# EAGLE schematic n64adv2 (EAGLE 9.6.2)

## Sheet 1 of 3
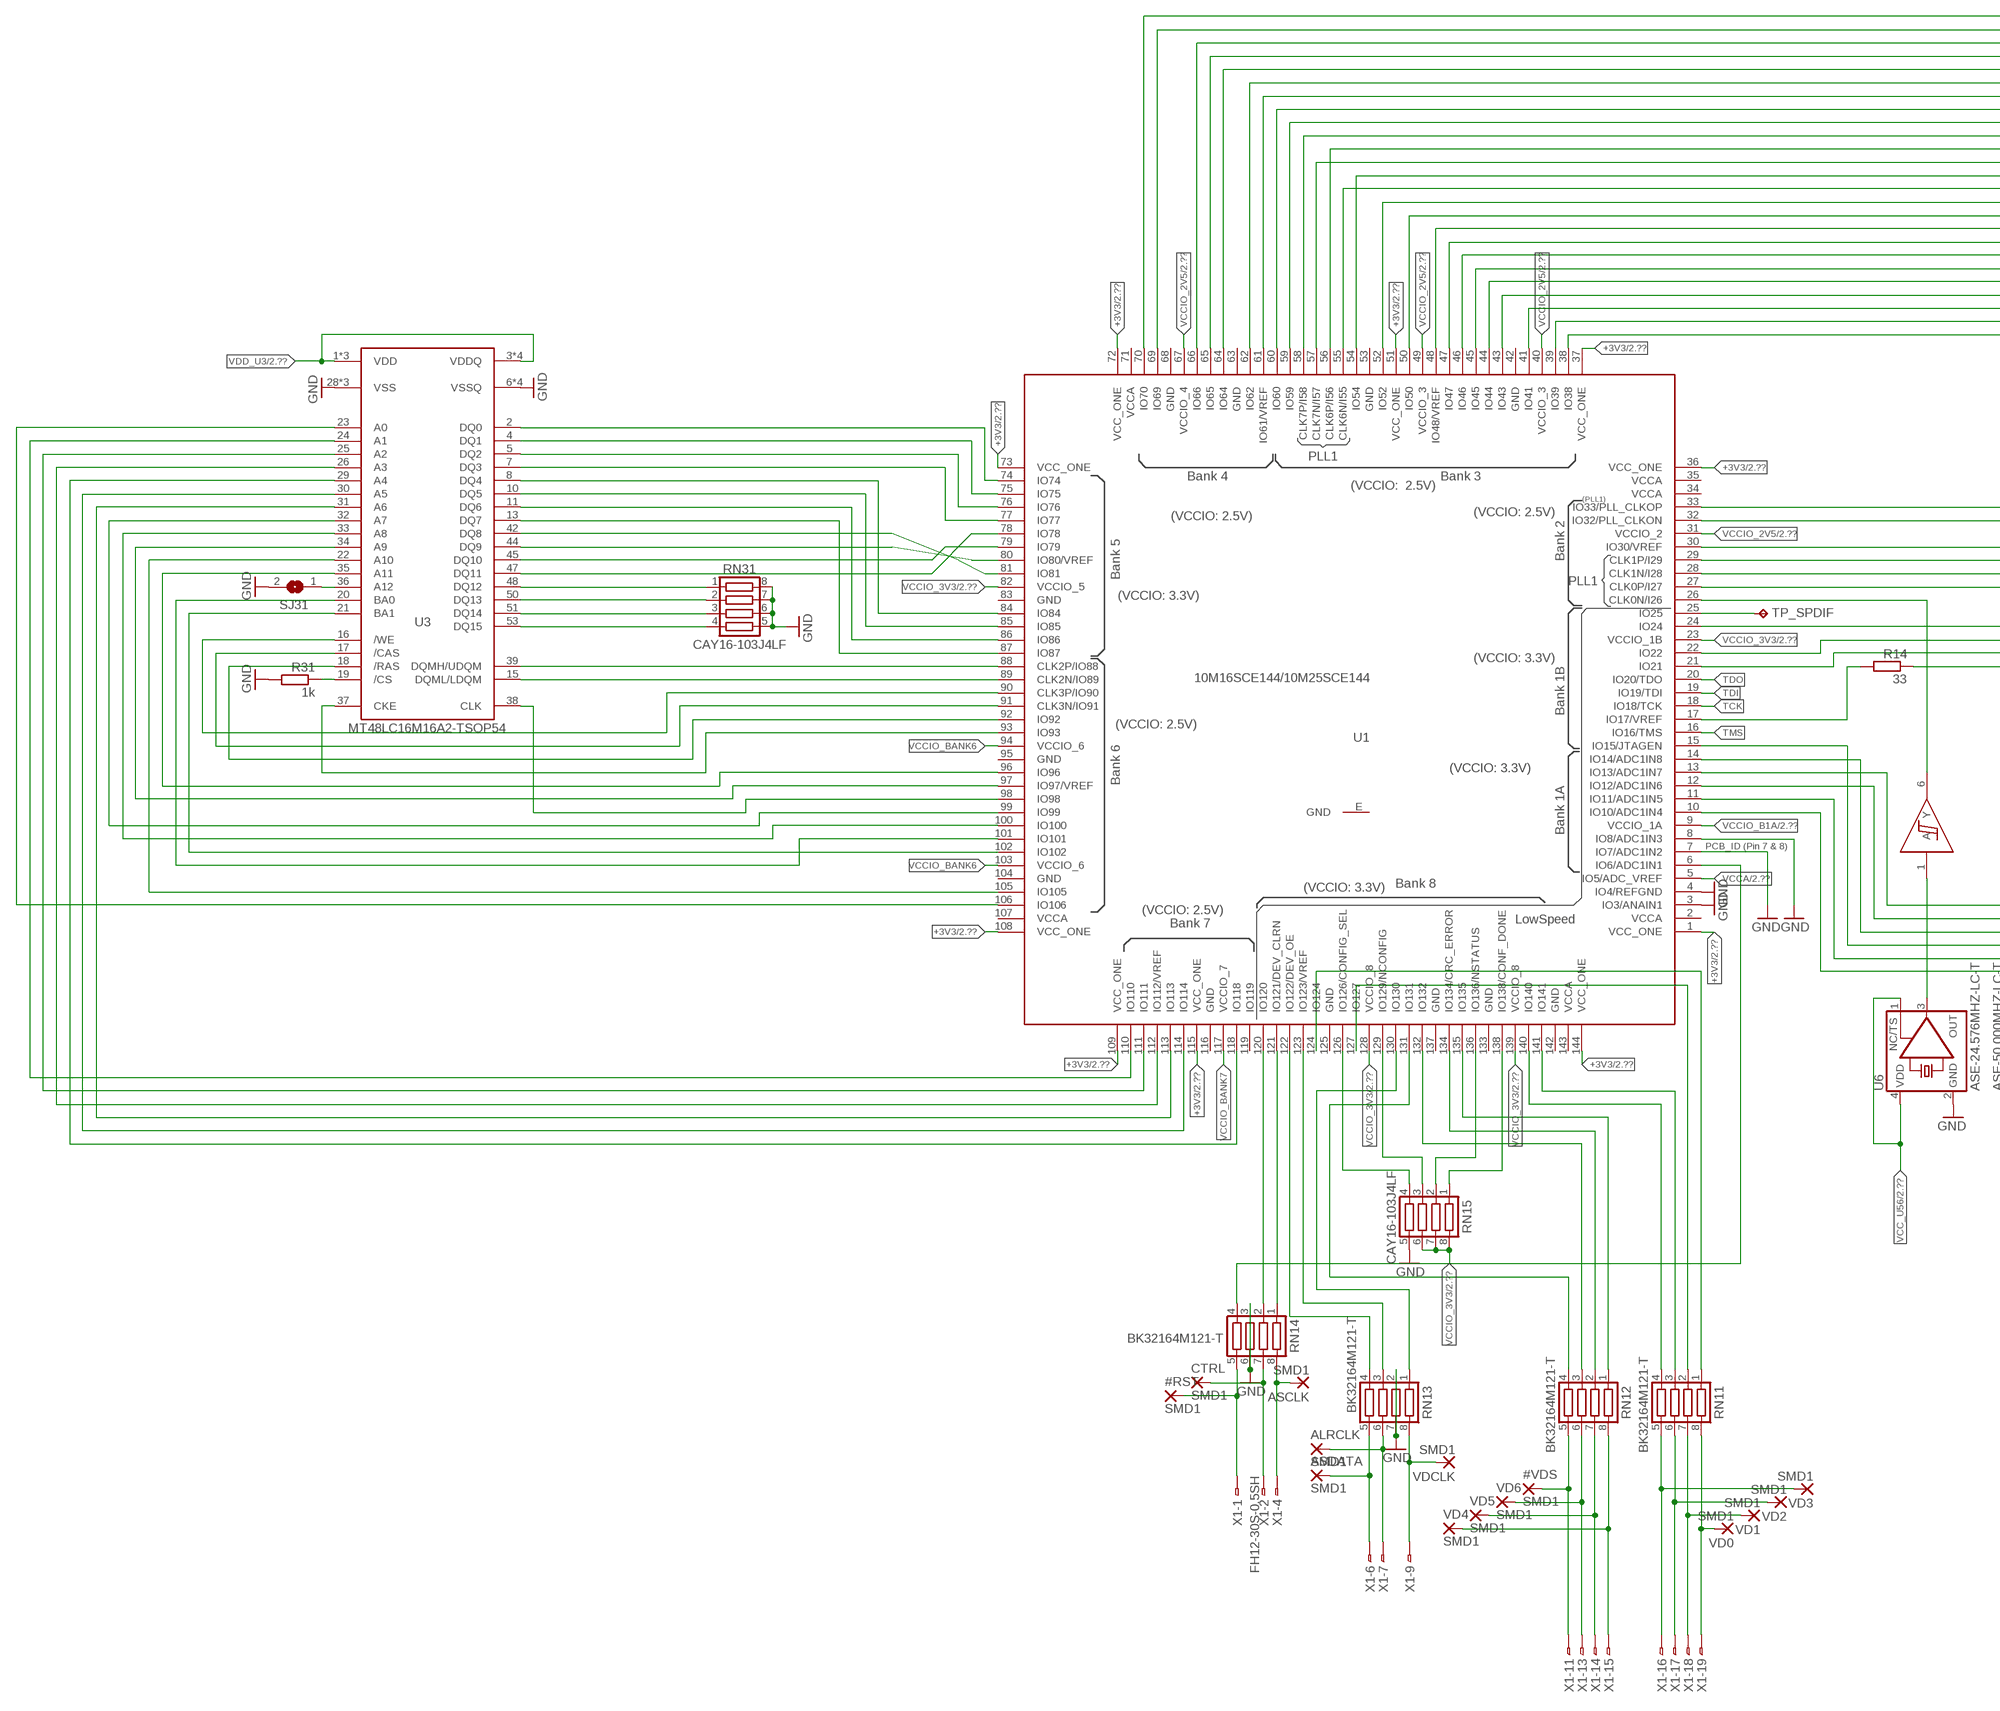
[diagram p0: schematic, sheet 1, part 1 of 2]
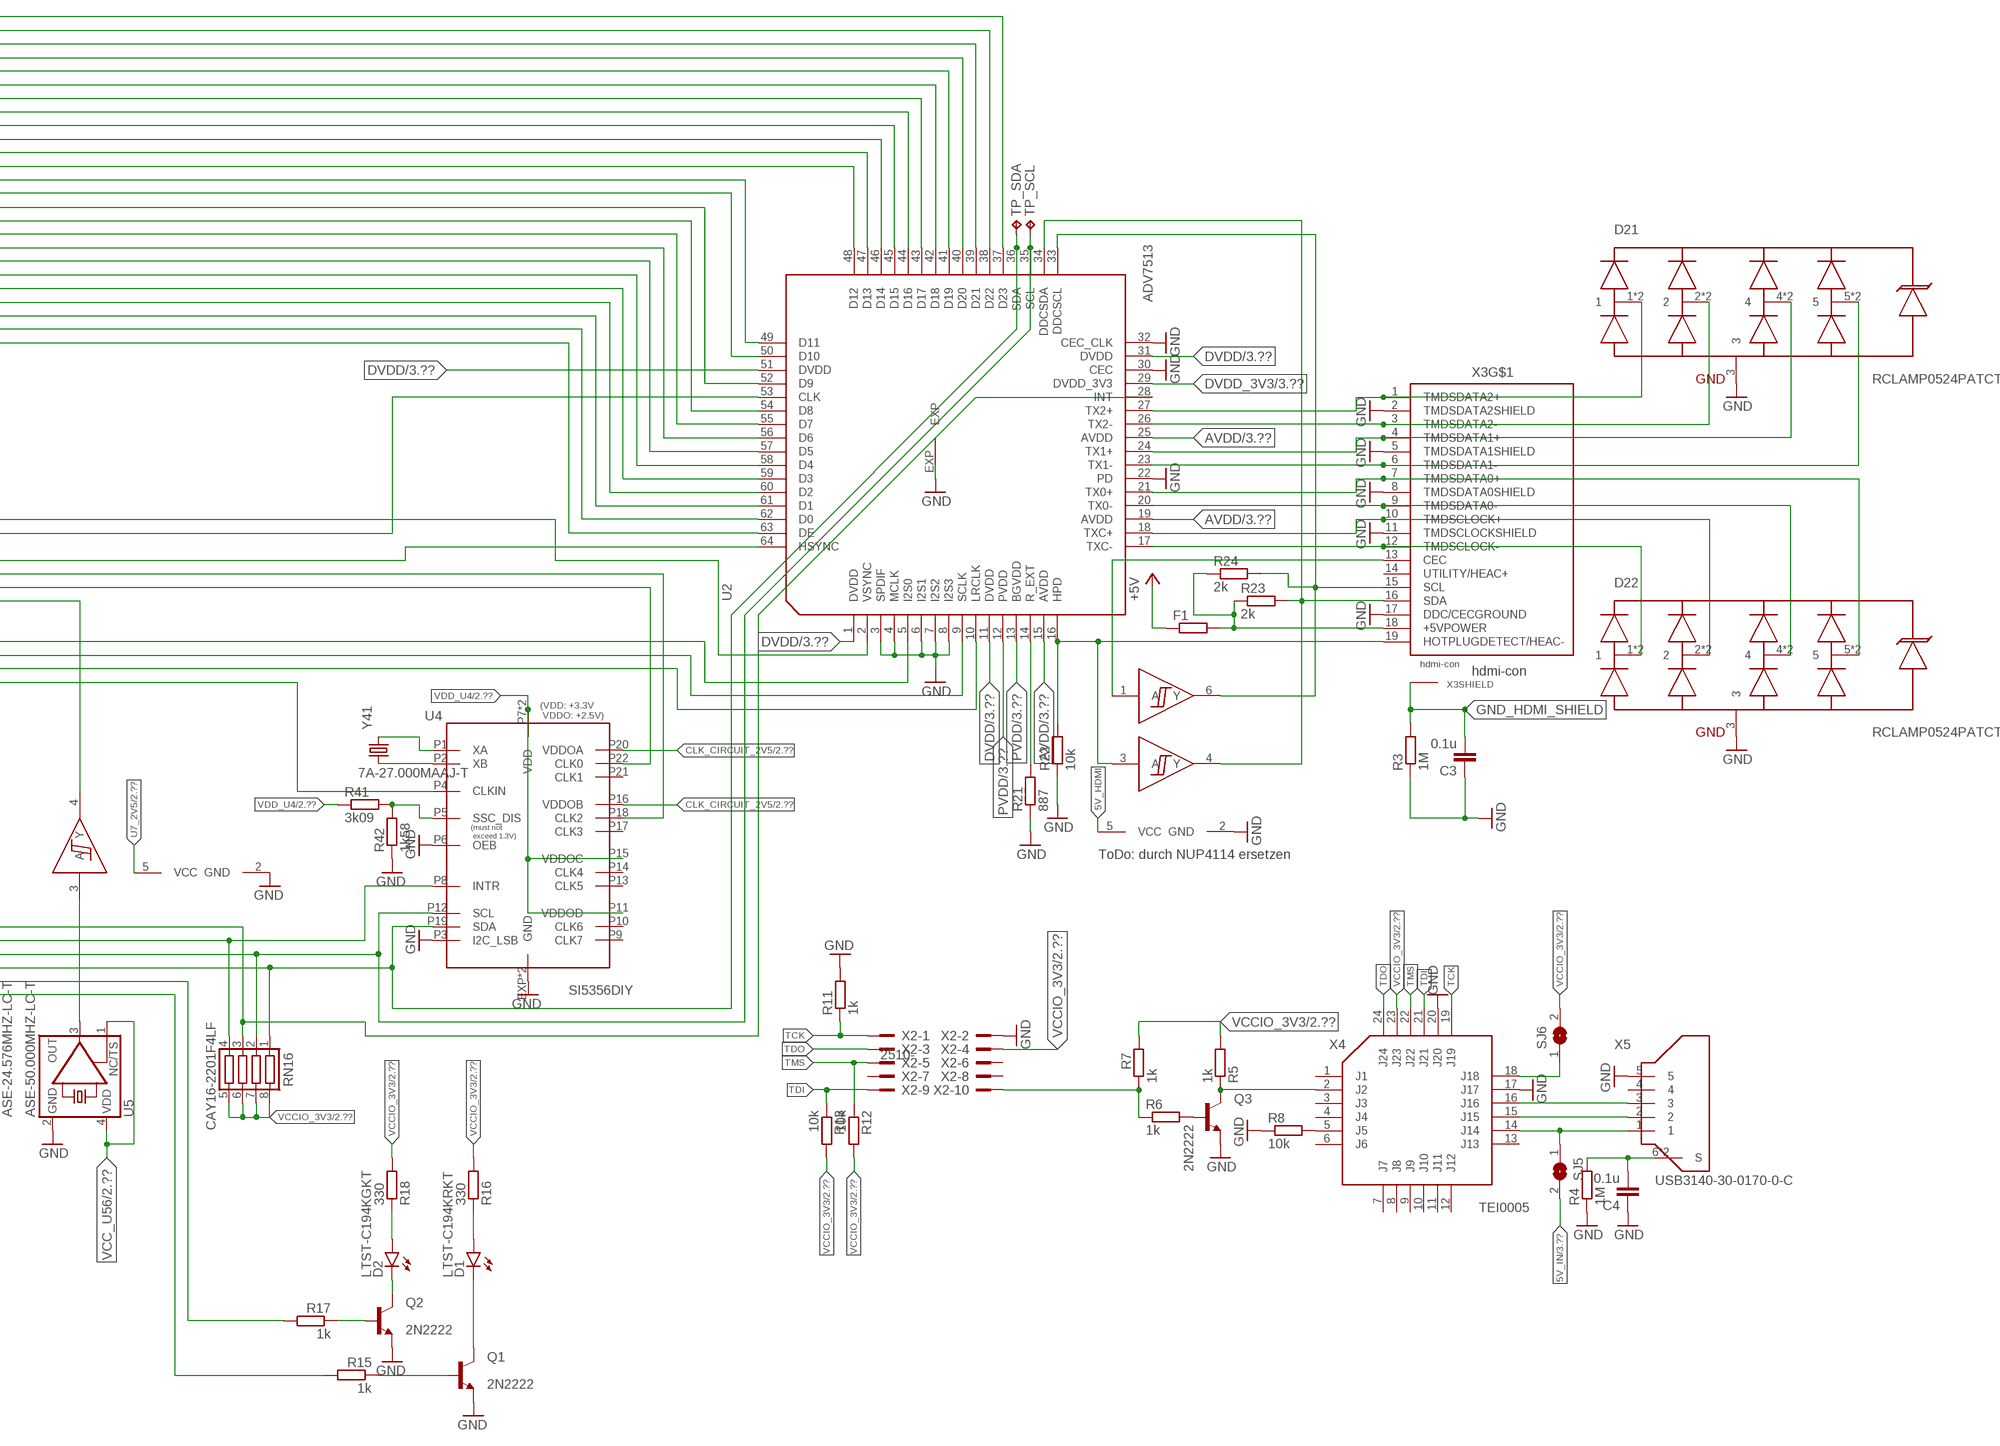
[diagram p1: schematic, sheet 1, part 2 of 2]

### Parts
#RST  SMD1  [SMD0,8-1,6]
#VDS  SMD1  [SMD0,8-1,6]
ALRCLK  SMD1  [SMD0,8-1,6]
ASCLK  SMD1  [SMD0,8-1,6]
ASDATA  SMD1  [SMD0,8-1,6]
C3  0.1u  C-EUC0603  [C0603]
C4  0.1u  C-EUC0603  [C0603]
CTRL  SMD1  [SMD0,8-1,6]
D1  LTST-C194KRKT  LEDCHIPLED_0805  [CHIPLED_0805]
D2  LTST-C194KGKT  LEDCHIPLED_0805  [CHIPLED_0805]
D21  RCLAMP0524PATCT  HDMI_RCLAMP  [HDMI_RCLAMP]
D22  RCLAMP0524PATCT  HDMI_RCLAMP  [HDMI_RCLAMP]
D23  2G17TI_DBV  [SOT-23-6]
F1  R-EU_R0603  [R0603]
Q1  2N2222  BC848ASMD  [SOT23]
Q2  2N2222  BC848ASMD  [SOT23]
Q3  2N2222  BC848ASMD  [SOT23]
R3  1M  R-EU_R0603  [R0603]
R4  1M  R-EU_R0603  [R0603]
R5  1k  R-EU_R0603  [R0603]
R6  1k  R-EU_R0603  [R0603]
R7  1k  R-EU_R0603  [R0603]
R8  10k  R-EU_R0603  [R0603]
R11  1k  R-EU_R0603  [R0603]
R12  10k  R-EU_R0603  [R0603]
R13  10k  R-EU_R0603  [R0603]
R14  33  R-EU_R0603  [R0603]
R15  1k  R-EU_R0603  [R0603]
R16  330  R-EU_R0603  [R0603]
R17  1k  R-EU_R0603  [R0603]
R18  330  R-EU_R0603  [R0603]
R21  887  R-EU_R0603  [R0603]
R22  10k  R-EU_R0603  [R0603]
R23  2k  R-EU_R0603  [R0603]
R24  2k  R-EU_R0603  [R0603]
R31  1k  R-EU_R0603  [R0603]
R41  3k09  R-EU_R0603  [R0603]
R42  1k58  R-EU_R0603  [R0603]
RN11  BK32164M121-T  CTS742C083  [CTS742C083]
RN12  BK32164M121-T  CTS742C083  [CTS742C083]
RN13  BK32164M121-T  CTS742C083  [CTS742C083]
RN14  BK32164M121-T  CTS742C083  [CTS742C083]
RN15  CAY16-103J4LF  CTS742C083  [CTS742C083]
RN16  CAY16-2201F4LF  CTS742C083  [CTS742C083]
RN31  CAY16-103J4LF  CTS742C083  [CTS742C083]
SJ5  SJSMALL  [SJ_SMALL]
SJ6  SJSMALL  [SJ_SMALL]
SJ31  SJSMALL  [SJ_SMALL]
TP_SCL  TPB1,27  [B1,27]
TP_SDA  TPB1,27  [B1,27]
TP_SPDIF  TPB1,27  [B1,27]
U1  10M16SCE144/10M25SCE144  10M16SAE144  [EQFP144_2]
U2  ADV7513  [LQFP64_EP]
U3  MT48LC16M16A2-TSOP54  [TSOP-54]
U4  SI5356DIY  [QFN-24-DIY]
U5  ASE-50.000MHZ-LC-T  KXO-PXO/XO-V96  [3.2X2.5_KXO-V96]
U6  ASE-24.576MHZ-LC-T  KXO-PXO/XO-V96  [3.2X2.5_KXO-V96]
U7  2G17TI_DBV  [SOT-23-6]
VD0  SMD1  [SMD0,8-1,6]
VD1  SMD1  [SMD0,8-1,6]
VD2  SMD1  [SMD0,8-1,6]
VD3  SMD1  [SMD0,8-1,6]
VD4  SMD1  [SMD0,8-1,6]
VD5  SMD1  [SMD0,8-1,6]
VD6  SMD1  [SMD0,8-1,6]
VDCLK  SMD1  [SMD0,8-1,6]
X1  FH12-30S-0.5SH  [FH12-30S-0.5SH]
X2  2510-  [PAK100/2500-10]
X3  hdmi-con  685119134923  [685119134923]
X4  TEI0005  [TEI0005]
X5  USB3140-30-0170-0-C  MICRO-USBDIY  [USB-MICRO-VERTICAL-DIY]
Y41  7A-27.000MAAJ-T  KX-9B  [5.0X3.2_2]

### Nets
3V3_X5_OUT: SJ6.1 X4.18(J18)
5V_HDMI: D23.5(VCC) F1.2 R23.1 R24.1 X3.18(+5VPOWER)
5V_IN: SJ5.2 ; also sheet 3
+3V3: U1.1(VCC_ONE) U1.36(VCC_ONE) U1.37(VCC_ONE) U1.51(VCC_ONE) U1.72(VCC_ONE) U1.73(VCC_ONE) U1.108(VCC_ONE) U1.109(VCC_ONE) U1.115(VCC_ONE) U1.144(VCC_ONE) ; also sheet 2
+5V: F1.1 ; also sheet 3
ALRCLK_FPGA_I: RN13.3 U1.123(IO123/VREF)
ALRCLK_I: ALRCLK.P$1(P) RN13.6 X1.7
ASCLK_FPGA_I: RN14.1 U1.121(IO121/DEV_CLRN)
ASCLK_I: ASCLK.P$1(P) RN14.8 X1.4
ASDATA_FPGA_I: RN13.4 U1.122(IO122/DEV_OE)
ASDATA_I: ASDATA.P$1(P) RN13.5 X1.6
AUDIO_MCLK: U6.3(OUT) U7.1(A)
AUDIO_MCLK_2V5BUF: U1.26(CLK0N/I26) U7.6(Y)
AVDD: U2.15(AVDD) U2.19(AVDD) U2.25(AVDD) ; also sheet 3
CLK_CIRCUIT_2V5: U4.P16(VDDOB) U4.P20(VDDOA) ; also sheet 2
CLK_TX: U1.32(IO32/PLL_CLKON) U2.53(CLK)
CONF_DONE: RN15.1 U1.138(IO138/CONF_DONE)
CONFIG_SEL: RN15.4 U1.126(IO126/CONFIG_SEL)
CTRL_FPGA_I: RN14.2 U1.120(IO120)
CTRL_I: CTRL.P$1(P) RN14.7 X1.2
DQMH: U1.88(CLK2P/IO88) U3.39(DQMH/UDQM)
DQML: U1.89(CLK2N/IO89) U3.15(DQML/LDQM)
DVDD: U2.1(DVDD) U2.11(DVDD) U2.31(DVDD) U2.51(DVDD) ; also sheet 3
DVDD_3V3: U2.29(DVDD_3V3) ; also sheet 3
GND: C3.1 C4.1 D21.3 D22.3 D23.2(GND) Q1.2(E) Q2.2(E) Q3.2(E) R3.1 R4.1 R8.1 R11.2 R21.1 R22.1 R31.2 R42.1 RN13.2 RN13.7 RN14.3 RN14.6 RN15.5 RN31.5 RN31.6 RN31.7 RN31.8 SJ31.2 U1.3(IO3/ANAIN1) U1.4(IO4/REFGND) U1.7(IO7/ADC1IN2) U1.8(IO8/ADC1IN3) U2.3(SPDIF) U2.4(MCLK) U2.6(I2S1) U2.7(I2S2) U2.8(I2S3) U2.22(PD) U2.30(CEC) U2.32(CEC_CLK) U2.EXP U3.6(VSSQ) U3.12(VSSQ) U3.28(VSS) U3.41(VSS) U3.46(VSSQ) U3.52(VSSQ) U3.54(VSS) U4.EXP(GND) U4.P3(I2C_LSB) U4.P6(OEB) U4.P23(GND) U5.2(GND) U6.2(GND) U7.2(GND) X2.2 X3.2(TMDSDATA2SHIELD) X3.5(TMDSDATA1SHIELD) X3.8(TMDSDATA0SHIELD) X3.11(TMDSCLOCKSHIELD) X3.17(DDC/CECGROUND) X4.17(J17) X4.20(J20) X5.5 ; also sheet 2,3
GND_HDMI_SHIELD: C3.2 R3.2 X3.SHELL1(SHIELD:SHIELD) X3.SHELL2(SHIELD:SHIELD) X3.SHELL3(SHIELD:SHIELD) X3.SHELL(SHIELD:SHIELD)
HDMI_CEC: D23.1(A) X3.13(CEC)
HDMI_CLK_MAIN_I: U1.28(CLK1N/I28) U4.P22(CLK0)
HDMI_CLK_SUB_I: U1.29(CLK1P/I29) U4.P18(CLK2)
HDMI_HPD: D23.3(A) R22.2 U2.16(HPD) X3.19(HOTPLUGDETECT/HEAC-)
HDMI_SCL: D23.6(Y) R24.2 U2.33(DDCSCL) X3.15(SCL)
HDMI_SDA: D23.4(Y) R23.2 U2.34(DDCSDA) X3.16(SDA)
HDMI_TX0+: D22.5 D22.6 U2.21(TX0+) X3.7(TMDSDATA0+)
HDMI_TX0-: D22.4 D22.7 U2.20(TX0-) X3.9(TMDSDATA0-)
HDMI_TX1+: D21.4 D21.7 U2.24(TX1+) X3.4(TMDSDATA1+)
HDMI_TX1-: D21.5 D21.6 U2.23(TX1-) X3.6(TMDSDATA1-)
HDMI_TX2+: D21.1 D21.10 U2.27(TX2+) X3.1(TMDSDATA2+)
HDMI_TX2-: D21.2 D21.9 U2.26(TX2-) X3.3(TMDSDATA2-)
HDMI_TXC+: D22.2 D22.9 U2.18(TXC+) X3.10(TMDSCLOCK+)
HDMI_TXC-: D22.1 D22.10 U2.17(TXC-) X3.12(TMDSCLOCK-)
I2S0: U1.24(IO24) U2.5(I2S0)
INT_ADV7513: RN16.3 U1.13(IO13/ADC1IN7) U2.28(INT)
INT_SI5356: RN16.4 U1.12(IO12/ADC1IN6) U4.P8(INTR)
LED1: Q1.1(B) R15.1
LED1_FPGA: R15.2 U1.10(IO10/ADC1IN4)
LED2: Q2.1(B) R17.1
LED2_FPGA: R17.2 U1.11(IO11/ADC1IN5)
LRCLK: U1.21(IO21) U2.10(LRCLK)
N$1: D1.A R16.1
N$2: D2.C Q2.3(C)
N$3: D1.C Q1.3(C)
N$4: R41.2 R42.2 U4.P5(SSC_DIS)
N$5: U4.P1(XA) Y41.2
N$9: U4.P2(XB) Y41.1
N$13: R6.1 R7.1 X2.10
N$30: Q3.1(B) R6.2
N$45: R21.2 U2.14(R_EXT)
N$99: D2.A R18.1
NCONFIG: RN15.3 U1.129(IO129/NCONFIG)
NRST_FPGA_IO: RN14.4 U1.6(IO6/ADC1IN1)
NRST_IO: #RST.P$1(P) RN14.5 X1.1
NSTATUS: RN15.2 U1.136(IO136/NSTATUS)
NVDS_FPGA_I: RN12.4 U1.131(IO131)
NVDS_I: #VDS.P$1(P) RN12.5 X1.11
PVDD: U2.12(PVDD) U2.13(BGVDD) ; also sheet 3
SCL: RN16.2 TP_SCL.TP U1.14(IO14/ADC1IN8) U2.35(SCL) U4.P12(SCL)
SCLK: U1.22(IO22) U2.9(SCLK)
SDA: RN16.1 TP_SDA.TP U1.15(IO15/JTAGEN) U2.36(SDA) U4.P19(SDA)
SDRAM_A0: U1.106(IO106) U3.23(A0)
SDRAM_A1: U1.110(IO110) U3.24(A1)
SDRAM_A2: U1.111(IO111) U3.25(A2)
SDRAM_A3: U1.112(IO112/VREF) U3.26(A3)
SDRAM_A4: U1.118(IO118) U3.29(A4)
SDRAM_A5: U1.114(IO114) U3.30(A5)
SDRAM_A6: U1.113(IO113) U3.31(A6)
SDRAM_A7: U1.99(IO99) U3.32(A7)
SDRAM_A8: U1.100(IO100) U3.33(A8)
SDRAM_A9: U1.97(IO97/VREF) U3.34(A9)
SDRAM_A10: U1.105(IO105) U3.22(A10)
SDRAM_A11: U1.96(IO96) U3.35(A11)
SDRAM_A12: SJ31.1 U3.36(A12)
SDRAM_BA0: U1.102(IO102) U3.21(BA1)
SDRAM_BA1: U1.101(IO101) U3.20(BA0)
SDRAM_CKE: U1.93(IO93) U3.37(CKE)
SDRAM_CLK: U1.98(IO98) U3.38(CLK)
SDRAM_DQ0: U1.74(IO74) U3.2(DQ0)
SDRAM_DQ1: U1.75(IO75) U3.4(DQ1)
SDRAM_DQ2: U1.76(IO76) U3.5(DQ2)
SDRAM_DQ3: U1.77(IO77) U3.7(DQ3)
SDRAM_DQ4: U1.84(IO84) U3.8(DQ4)
SDRAM_DQ5: U1.85(IO85) U3.10(DQ5)
SDRAM_DQ6: U1.86(IO86) U3.11(DQ6)
SDRAM_DQ7: U1.87(IO87) U3.13(DQ7)
SDRAM_DQ8: U1.81(IO81) U3.42(DQ8)
SDRAM_DQ9: U1.80(IO80/VREF) U3.44(DQ9)
SDRAM_DQ10: U1.79(IO79) U3.45(DQ10)
SDRAM_DQ11: U1.78(IO78) U3.47(DQ11)
SDRAM_DQ12: RN31.1 U3.48(DQ12)
SDRAM_DQ13: RN31.2 U3.50(DQ13)
SDRAM_DQ14: RN31.3 U3.51(DQ14)
SDRAM_DQ15: RN31.4 U3.53(DQ15)
SDRAM_NCAS: U1.91(CLK3N/IO91) U3.17(/CAS)
SDRAM_NCS: R31.1 U3.19(/CS)
SDRAM_NRAS: U1.92(IO92) U3.18(/RAS)
SDRAM_NWE: U1.90(CLK3P/IO90) U3.16(/WE)
SPDIF: TP_SPDIF.TP U1.25(IO25)
SYS_CLK: U5.3(OUT) U7.3(A)
SYS_CLK_2V5_BUF: U1.27(CLK0P/I27) U7.4(Y)
TCK: R11.1 U1.18(IO18/TCK) X2.1 X4.19(J19)
TDI: R13.1 U1.19(IO19/TDI) X2.9 X4.21(J21)
TDO: U1.20(IO20/TDO) X2.3 X4.24(J24)
TMS: R12.1 U1.16(IO16/TMS) X2.5 X4.22(J22)
TX_B0: U1.39(IO39) U2.62(D0)
TX_B1: U1.41(IO41) U2.61(D1)
TX_B2: U1.43(IO43) U2.60(D2)
TX_B3: U1.44(IO44) U2.59(D3)
TX_B4: U1.45(IO45) U2.58(D4)
TX_B5: U1.46(IO46) U2.57(D5)
TX_B6: U1.47(IO47) U2.56(D6)
TX_B7: U1.48(IO48/VREF) U2.55(D7)
TX_DE: U1.38(IO38) U2.63(DE)
TX_G0: U1.50(IO50) U2.54(D8)
TX_G1: U1.52(IO52) U2.52(D9)
TX_G2: U1.55(CLK6N/I55) U2.50(D10)
TX_G3: U1.54(IO54) U2.49(D11)
TX_G4: U1.57(CLK7N/I57) U2.48(D12)
TX_G5: U1.56(CLK6P/I56) U2.47(D13)
TX_G6: U1.58(CLK7P/I58) U2.46(D14)
TX_G7: U1.59(IO59) U2.45(D15)
TX_HSYNC: U1.30(IO30/VREF) U2.64(HSYNC)
TX_R0: U1.60(IO60) U2.44(D16)
TX_R1: U1.61(IO61/VREF) U2.43(D17)
TX_R2: U1.62(IO62) U2.42(D18)
TX_R3: U1.64(IO64) U2.41(D19)
TX_R4: U1.65(IO65) U2.40(D20)
TX_R5: U1.66(IO66) U2.39(D21)
TX_R6: U1.69(IO69) U2.38(D22)
TX_R7: U1.70(IO70) U2.37(D23)
TX_VSYNC: U1.33(IO33/PLL_CLKOP) U2.2(VSYNC)
U7_2V5: U7.5(VCC) ; also sheet 2
USB_D+: X4.16(J16) X5.3
USB_D-: X4.15(J15) X5.2
USB_GND_SHIELD: C4.2 R4.2 X5.6(S) X5.7(S)
USB_VBUS: SJ5.1 X4.14(J14) X5.1
VCC_U56: U5.1(TS) U5.4(VDD) U6.1(TS) U6.4(VDD) ; also sheet 2
VCCA: U1.5(IO5/ADC_VREF) ; also sheet 2
VCCIO_2V5: U1.31(VCCIO_2) U1.40(VCCIO_3) U1.49(VCCIO_3) U1.67(VCCIO_4) ; also sheet 2
VCCIO_3V3: R5.2 R7.2 R12.2 R13.2 R16.2 R18.2 RN15.6 RN15.7 RN15.8 RN16.5 RN16.6 RN16.7 RN16.8 SJ6.2 U1.23(VCCIO_1B) U1.82(VCCIO_5) U1.128(VCCIO_8) U1.139(VCCIO_8) X2.4 X4.23(J23) ; also sheet 2
VCCIO_B1A: U1.9(VCCIO_1A) ; also sheet 2
VCCIO_BANK6: U1.94(VCCIO_6) U1.103(VCCIO_6) ; also sheet 2
VCCIO_BANK7: U1.117(VCCIO_7) ; also sheet 2
VCLK_FEEDBACK: R14.2 U1.17(IO17/VREF)
VCLK_FEEDBACK_BUF: R14.1 U4.P4(CLKIN)
VD0_FPGA_I: RN11.1 U1.124(IO124)
VD0_I: RN11.8 VD0.P$1(P) X1.19
VD1_FPGA_I: RN11.2 U1.127(IO127)
VD1_I: RN11.7 VD1.P$1(P) X1.18
VD2_FPGA_I: RN11.3 U1.141(IO141)
VD2_I: RN11.6 VD2.P$1(P) X1.17
VD3_FPGA_I: RN11.4 U1.140(IO140)
VD3_I: RN11.5 VD3.P$1(P) X1.16
VD4_FPGA_I: RN12.1 U1.135(IO135)
VD4_I: RN12.8 VD4.P$1(P) X1.15
VD5_FPGA_I: RN12.2 U1.134(IO134/CRC_ERROR)
VD5_I: RN12.7 VD5.P$1(P) X1.14
VD6_FPGA_I: RN12.3 U1.132(IO132)
VD6_I: RN12.6 VD6.P$1(P) X1.13
VDCLK_FPGA_I: RN13.1 U1.130(IO130)
VDCLK_I: RN13.8 VDCLK.P$1(P) X1.9
VDD_U3: U3.1(VDD) U3.3(VDDQ) U3.9(VDDQ) U3.14(VDD) U3.27(VDD) U3.43(VDDQ) U3.49(VDDQ) ; also sheet 2
VDD_U4: R41.1 U4.P7(VDD) U4.P11(VDDOD) U4.P15(VDDOC) U4.P24(VDD) ; also sheet 2
X4_OEN: Q3.3(C) R5.1 X4.2(J2)
X5_UART_RX: R8.2 X4.5(J5)
Unconnected: U1.119(IO119) U4.P9(CLK7) U4.P10(CLK6) U4.P13(CLK5) U4.P14(CLK4) U4.P17(CLK3) U4.P21(CLK1) X2.6 X2.7 X2.8 X3.14(UTILITY/HEAC+) X4.1(J1) X4.3(J3) X4.4(J4) X4.6(J6) X4.7(J7) X4.8(J8) X4.9(J9) X4.10(J10) X4.11(J11) X4.12(J12) X4.13(J13) X5.4

### Notes on the sheet
- (VCCIO:  2.5V)
- (VCCIO: 2.5V)
- (VCCIO: 2.5V)
- (VCCIO: 3.3V)
- (VCCIO: 3.3V)
- (VDD: +3.3V
   VDDO: +2.5V)
- (VCCIO: 2.5V)
- (VCCIO: 3.3V)
- (must not
   exceed 1.3V)
- ToDo: durch NUP4114 ersetzen
- PCB_ID (Pin 7 & 8)
- (VCCIO: 3.3V)
- (VCCIO: 2.5V)

## Sheet 2 of 3
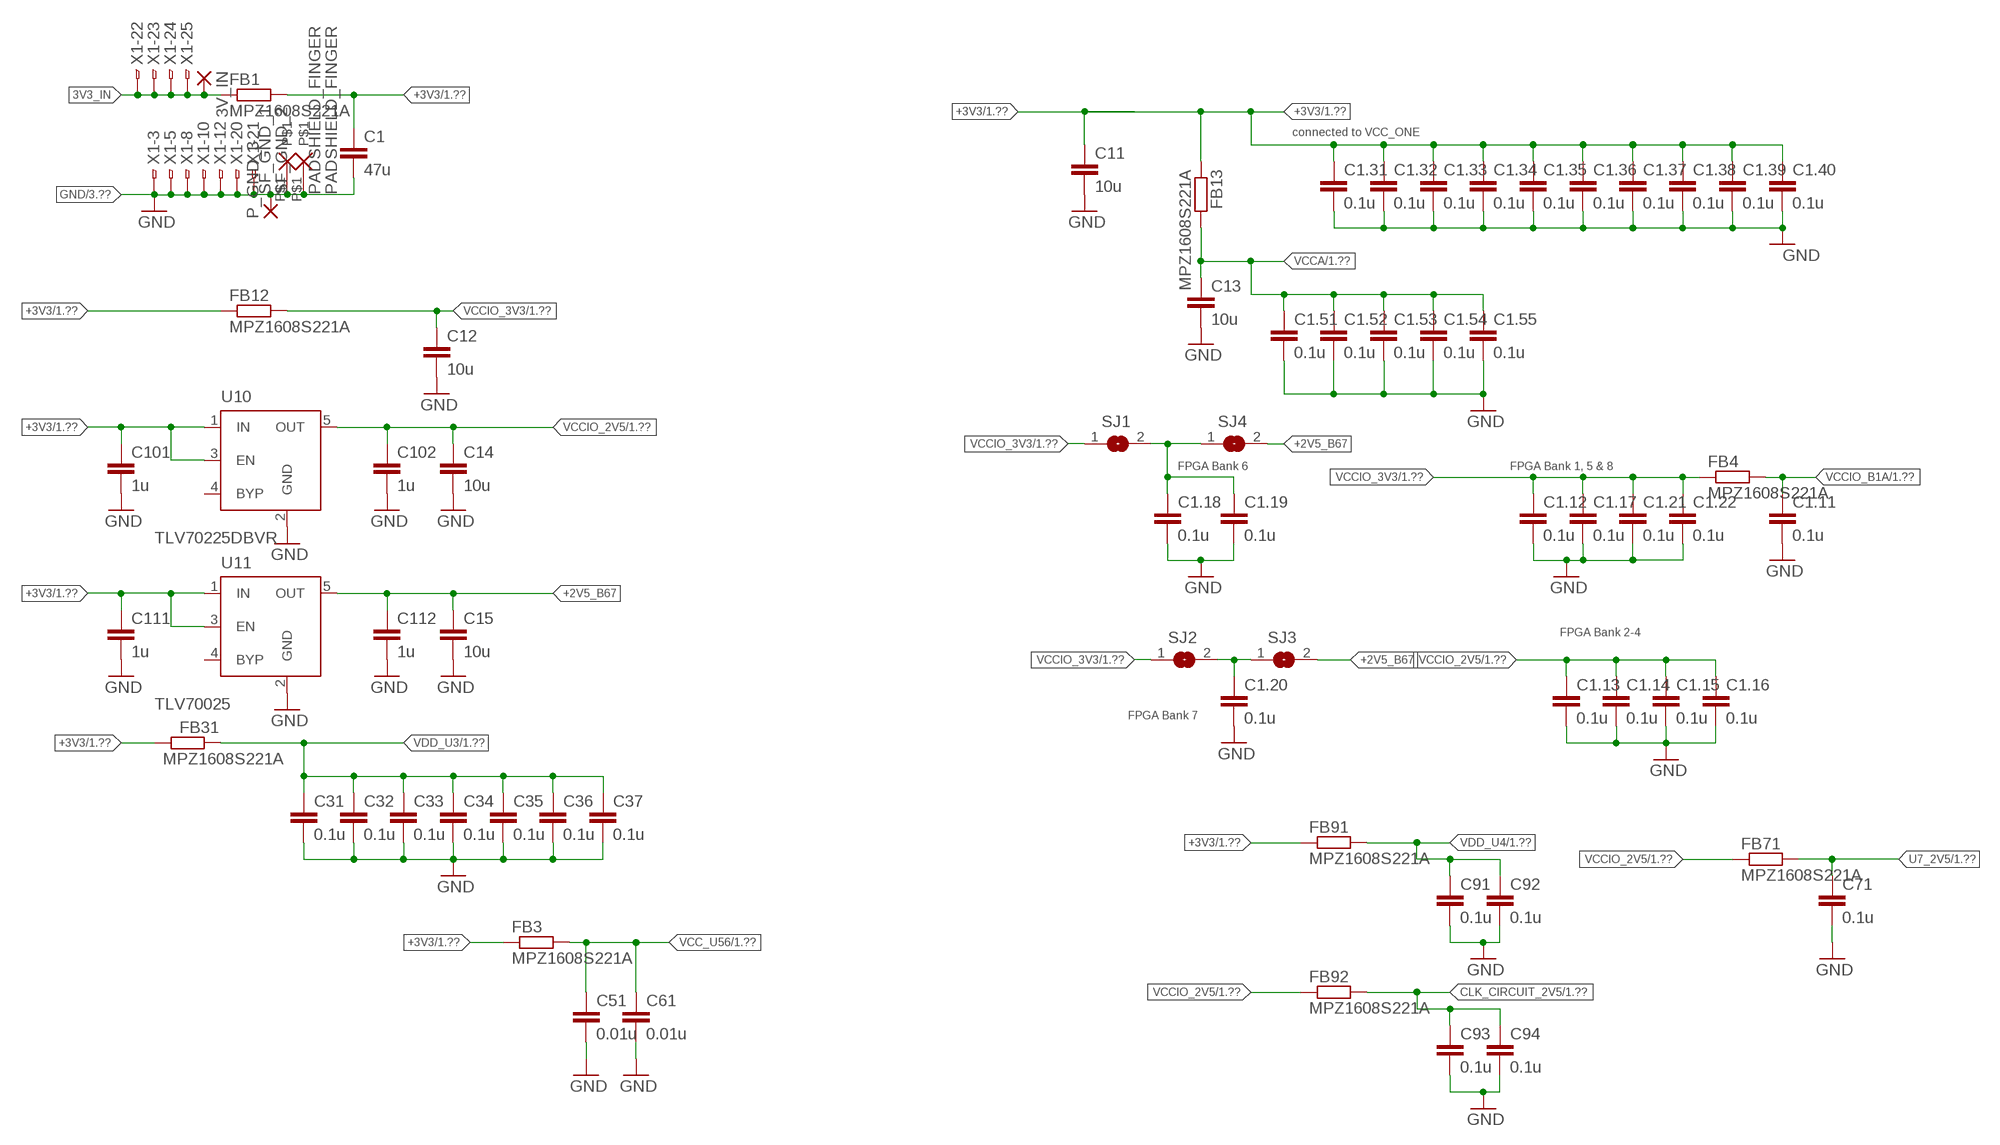
[diagram p2: schematic, sheet 2]

### Parts
3V_IN  SMD2  [SMD1,27-2,54]
C1  47u  C-EUC0805  [C0805]
C1.11  0.1u  C-EUC0603  [C0603]
C1.12  0.1u  C-EUC0603  [C0603]
C1.13  0.1u  C-EUC0603  [C0603]
C1.14  0.1u  C-EUC0603  [C0603]
C1.15  0.1u  C-EUC0603  [C0603]
C1.16  0.1u  C-EUC0603  [C0603]
C1.17  0.1u  C-EUC0603  [C0603]
C1.18  0.1u  C-EUC0603  [C0603]
C1.19  0.1u  C-EUC0603  [C0603]
C1.20  0.1u  C-EUC0603  [C0603]
C1.21  0.1u  C-EUC0603  [C0603]
C1.22  0.1u  C-EUC0603  [C0603]
C1.31  0.1u  C-EUC0603  [C0603]
C1.32  0.1u  C-EUC0603  [C0603]
C1.33  0.1u  C-EUC0603  [C0603]
C1.34  0.1u  C-EUC0603  [C0603]
C1.35  0.1u  C-EUC0603  [C0603]
C1.36  0.1u  C-EUC0603  [C0603]
C1.37  0.1u  C-EUC0603  [C0603]
C1.38  0.1u  C-EUC0603  [C0603]
C1.39  0.1u  C-EUC0603  [C0603]
C1.40  0.1u  C-EUC0603  [C0603]
C1.51  0.1u  C-EUC0603  [C0603]
C1.52  0.1u  C-EUC0603  [C0603]
C1.53  0.1u  C-EUC0603  [C0603]
C1.54  0.1u  C-EUC0603  [C0603]
C1.55  0.1u  C-EUC0603  [C0603]
C11  10u  C-EUC0805  [C0805]
C12  10u  C-EUC0805  [C0805]
C13  10u  C-EUC0805  [C0805]
C14  10u  C-EUC0805  [C0805]
C15  10u  C-EUC0805  [C0805]
C31  0.1u  C-EUC0603  [C0603]
C32  0.1u  C-EUC0603  [C0603]
C33  0.1u  C-EUC0603  [C0603]
C34  0.1u  C-EUC0603  [C0603]
C35  0.1u  C-EUC0603  [C0603]
C36  0.1u  C-EUC0603  [C0603]
C37  0.1u  C-EUC0603  [C0603]
C51  0.01u  C-EUC0603  [C0603]
C61  0.01u  C-EUC0603  [C0603]
C71  0.1u  C-EUC0603  [C0603]
C91  0.1u  C-EUC0603  [C0603]
C92  0.1u  C-EUC0603  [C0603]
C93  0.1u  C-EUC0603  [C0603]
C94  0.1u  C-EUC0603  [C0603]
C101  1u  C-EUC0603  [C0603]
C102  1u  C-EUC0603  [C0603]
C111  1u  C-EUC0603  [C0603]
C112  1u  C-EUC0603  [C0603]
FB1  MPZ1608S221A  R-EU_R0603  [R0603]
FB3  MPZ1608S221A  R-EU_R0603  [R0603]
FB4  MPZ1608S221A  R-EU_R0603  [R0603]
FB12  MPZ1608S221A  R-EU_R0603  [R0603]
FB13  MPZ1608S221A  R-EU_R0603  [R0603]
FB31  MPZ1608S221A  R-EU_R0603  [R0603]
FB71  MPZ1608S221A  R-EU_R0603  [R0603]
FB91  MPZ1608S221A  R-EU_R0603  [R0603]
FB92  MPZ1608S221A  R-EU_R0603  [R0603]
P_GND_3  SMD2  [SMD1,27-2,54]
SF_GND_1  PADSHIELD_FINGER  [GND_FINGER_PAD]
SF_GND_2  PADSHIELD_FINGER  [GND_FINGER_PAD]
SJ1  SJSMALL  [SJ_SMALL]
SJ2  SJSMALL  [SJ_SMALL]
SJ3  SJSMALL  [SJ_SMALL]
SJ4  SJSMALL  [SJ_SMALL]
U10  TLV70225DBVR  MIC5219XX  [SOT23-5]
U11  TLV70025  MIC5219XX  [SOT23-5]

### Nets
3V3_IN: 3V_IN.1(P) FB1.1 X1.22 X1.23 X1.24 X1.25
+2V5_B67: C15.1 C112.1 SJ3.2 SJ4.2 U11.5(OUT)
+3V3: C1.1 C1.31.1 C1.32.1 C1.33.1 C1.34.1 C1.35.1 C1.36.1 C1.37.1 C1.38.1 C1.39.1 C1.40.1 C11.1 C101.1 C111.1 FB1.2 FB3.1 FB12.1 FB13.1 FB31.1 FB91.1 U10.1(IN) U10.3(EN) U11.1(IN) U11.3(EN) ; also sheet 1
CLK_CIRCUIT_2V5: C93.1 C94.1 FB92.2 ; also sheet 1
GND: C1.2 C1.11.2 C1.12.2 C1.13.2 C1.14.2 C1.15.2 C1.16.2 C1.17.2 C1.18.2 C1.19.2 C1.20.2 C1.21.2 C1.22.2 C1.31.2 C1.32.2 C1.33.2 C1.34.2 C1.35.2 C1.36.2 C1.37.2 C1.38.2 C1.39.2 C1.40.2 C1.51.2 C1.52.2 C1.53.2 C1.54.2 C1.55.2 C11.2 C12.2 C13.2 C14.2 C15.2 C31.2 C32.2 C33.2 C34.2 C35.2 C36.2 C37.2 C51.2 C61.2 C71.2 C91.2 C92.2 C93.2 C94.2 C101.2 C102.2 C111.2 C112.2 P_GND_3.1(P) SF_GND_1.P$1 SF_GND_2.P$1 U10.2(GND) U11.2(GND) X1.3 X1.5 X1.8 X1.10 X1.12 X1.20 X1.21 ; also sheet 1,3
U7_2V5: C71.1 FB71.2 ; also sheet 1
VCC_U56: C51.1 C61.1 FB3.2 ; also sheet 1
VCCA: C1.51.1 C1.52.1 C1.53.1 C1.54.1 C1.55.1 C13.1 FB13.2 ; also sheet 1
VCCIO_2V5: C1.13.1 C1.14.1 C1.15.1 C1.16.1 C14.1 C102.1 FB71.1 FB92.1 U10.5(OUT) ; also sheet 1
VCCIO_3V3: C1.12.1 C1.17.1 C1.21.1 C1.22.1 C12.1 FB4.1 FB12.2 SJ1.1 SJ2.1 ; also sheet 1
VCCIO_B1A: C1.11.1 FB4.2 ; also sheet 1
VCCIO_BANK6: C1.18.1 C1.19.1 SJ1.2 SJ4.1 ; also sheet 1
VCCIO_BANK7: C1.20.1 SJ2.2 SJ3.1 ; also sheet 1
VDD_U3: C31.1 C32.1 C33.1 C34.1 C35.1 C36.1 C37.1 FB31.2 ; also sheet 1
VDD_U4: C91.1 C92.1 FB91.2 ; also sheet 1
Unconnected: U10.4(BYP) U11.4(BYP)

### Notes on the sheet
- connected to VCC_ONE
- FPGA Bank 6 | FPGA Bank 1, 5 & 8
- FPGA Bank 2-4
- FPGA Bank 7

## Sheet 3 of 3
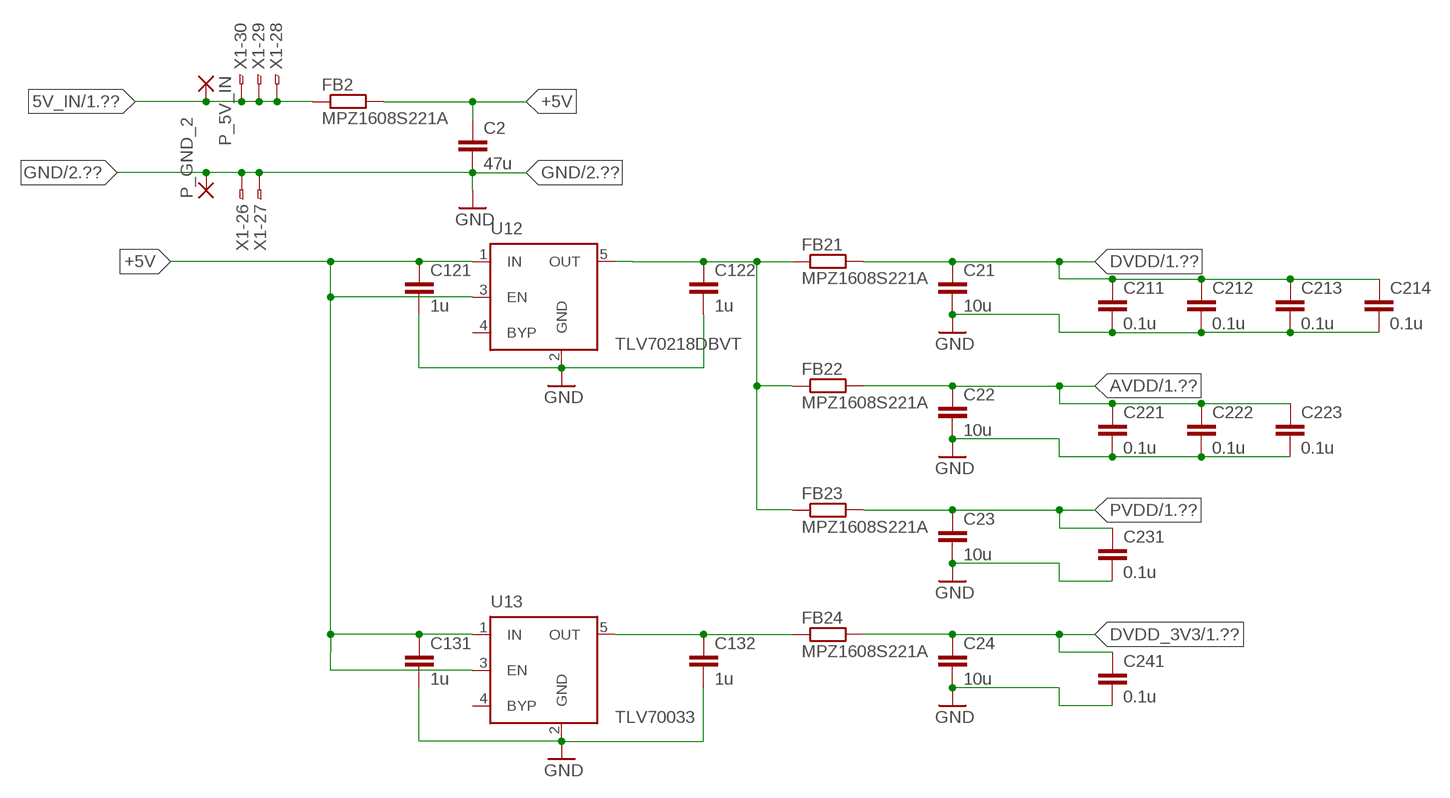
[diagram p3: schematic, sheet 3]

### Parts
C2  47u  C-EUC0805  [C0805]
C21  10u  C-EUC0805  [C0805]
C22  10u  C-EUC0805  [C0805]
C23  10u  C-EUC0805  [C0805]
C24  10u  C-EUC0805  [C0805]
C121  1u  C-EUC0603  [C0603]
C122  1u  C-EUC0603  [C0603]
C131  1u  C-EUC0603  [C0603]
C132  1u  C-EUC0603  [C0603]
C211  0.1u  C-EUC0603  [C0603]
C212  0.1u  C-EUC0603  [C0603]
C213  0.1u  C-EUC0603  [C0603]
C214  0.1u  C-EUC0603  [C0603]
C221  0.1u  C-EUC0603  [C0603]
C222  0.1u  C-EUC0603  [C0603]
C223  0.1u  C-EUC0603  [C0603]
C231  0.1u  C-EUC0603  [C0603]
C241  0.1u  C-EUC0603  [C0603]
FB2  MPZ1608S221A  R-EU_R0603  [R0603]
FB21  MPZ1608S221A  R-EU_R0603  [R0603]
FB22  MPZ1608S221A  R-EU_R0603  [R0603]
FB23  MPZ1608S221A  R-EU_R0603  [R0603]
FB24  MPZ1608S221A  R-EU_R0603  [R0603]
P_5V_IN  SMD2  [SMD1,27-2,54]
P_GND_2  SMD2  [SMD1,27-2,54]
U12  TLV70218DBVT  MIC5219XX  [SOT23-5]
U13  TLV70033  MIC5219XX  [SOT23-5]

### Nets
1.8V_PRE: C122.1 FB21.1 FB22.1 FB23.1 U12.5(OUT)
3.3V_PRE: C132.1 FB24.1 U13.5(OUT)
5V_IN: FB2.1 P_5V_IN.1(P) X1.28 X1.29 X1.30 ; also sheet 1
+5V: C2.1 C121.1 C131.1 FB2.2 U12.1(IN) U12.3(EN) U13.1(IN) U13.3(EN) ; also sheet 1
AVDD: C22.1 C221.1 C222.1 C223.1 FB22.2 ; also sheet 1
DVDD: C21.1 C211.1 C212.1 C213.1 C214.1 FB21.2 ; also sheet 1
DVDD_3V3: C24.1 C241.1 FB24.2 ; also sheet 1
GND: C2.2 C21.2 C22.2 C23.2 C24.2 C121.2 C122.2 C131.2 C132.2 C211.2 C212.2 C213.2 C214.2 C221.2 C222.2 C223.2 C231.2 C241.2 P_GND_2.1(P) U12.2(GND) U13.2(GND) X1.26 X1.27 ; also sheet 1,2
PVDD: C23.1 C231.1 FB23.2 ; also sheet 1
Unconnected: U12.4(BYP) U13.4(BYP)

## Power pins joined to a net without a drawn wire
GND: U1.42(GND) U1.53(GND) U1.63(GND) U1.68(GND) U1.83(GND) U1.95(GND) U1.104(GND) U1.116(GND) U1.125(GND) U1.133(GND) U1.137(GND) U1.142(GND) U1.E(GND)
VCCA: U1.2(VCCA) U1.34(VCCA) U1.35(VCCA) U1.71(VCCA) U1.107(VCCA) U1.143(VCCA)

## Library data of the parts
3V_IN P_5V_IN P_GND_2 P_GND_3 = wirepad:SMD2: SMD PAD
#RST #VDS ALRCLK ASCLK ASDATA CTRL VD0 VD1-VD6 VDCLK = wirepad:SMD1
C1 C1.11-C1.22 C1.31-C1.40 C1.51-C1.55 C2-C4 C11-C15 C21-C24 C31-C37 C51 C61 C71 C91-C94 C101 C102 C111 C112 C121 C122 C131 C132 C211-C214 C221-C223 C231 C241 = rcl:C-EU: CAPACITOR, European symbol
D1 D2 = led:LED: LED
D21 D22 = snes_div:HDMI_RCLAMP
D23 U7 = snes_div:2G17
F1 FB1-FB4 FB12 FB13 FB21-FB24 FB31 FB71 FB91 FB92 R3-R8 R11-R18 R21-R24 R31 R41 R42 = rcl:R-EU_: RESISTOR, European symbol
Q1-Q3 = transistor-npn:BC848*: NPN Transistor
RN11-RN16 RN31 = resistor-net:CTS742C083: Chip Resistor Array 4 Single Resistor Source: http://www.ctscorp.com/components/Datasheets/CTSChipArrayDs.pdf; OC_FARNELL: unknown; OC_NEWARK: unknown
SF_GND_1 SF_GND_2 = snes_div:PAD
SJ1-SJ6 SJ31 = jumper:SJ: SMD solder JUMPER
TP_SCL TP_SDA TP_SPDIF = testpad:TP: Test pad
U1 = altera:10M16SAE144
U2 = analog-devices:ADV7513
U3 = snes_div:MT48LC16M16A2
U4 = silabs:SI5356
U5 U6 = crystal-geyer_V1_0:KXO-PXO/XO-V: Clock Oscillator (PXO/XO) MHz : KXO-V - Serie Model Size l/w/h [mm] Frequency Range Frequency Stability Temp. Range [°C] Output AECQ 200 availabel Datasheet KXO-V94 KXO-V94 KXO-V95 KXO-V95 KXO-V96 KXO-V96 KXO-V99 KXO-V99 KXO-97 KXO-V97 KXO-97 - KXO-V97 2.0/1.6/0.80 2.0/1.6/0.80 2.5/2.0/0.82 ...
U10-U13 = v-reg-micrel:MIC5219XX: VOLTAGE REGULATOR; OC_FARNELL: unknown; OC_NEWARK: unknown
X1 = con-hirose:FH12-30S-0.5S: 0.5mm Pitch Connectors For FPC/FFC Source: Data sheet <http://www.hirose.co.jp/cataloge_hp/e58605370.pdf>; MPN: FH12-30S-0.5SH(55); OC_FARNELL: 1324555; OC_NEWARK: 34M6176
X2 = con-3m:2510-: 3M (TM) Pak 100 4-Wall Header Source: 3M; MF: 3M; MPN: 2510-6002UB; OC_FARNELL: 9838244; OC_NEWARK: 46F4725
X3 = WE_IO_rev18a:685119134923: WR-COM SMT Horizontal HDMI, 19 pins=>Code : Con_I-O_COM_HDMI_685119134923 <http://katalog.we-online.de/media/images/eican/Con_I-O_COM_HDMI_685119134923_pf2.jpg> Details see: http://katalog.we-online.de/en/em/COM_SMT_HORIZONTAL/685119134923 Created 2014-07-09, Karrer Zheng 2014 (C) Würth Elektronik
X4 = trenz:TEI0005
X5 = trenz:MICRO-USB
Y41 = crystal-geyer_V1_0:KX